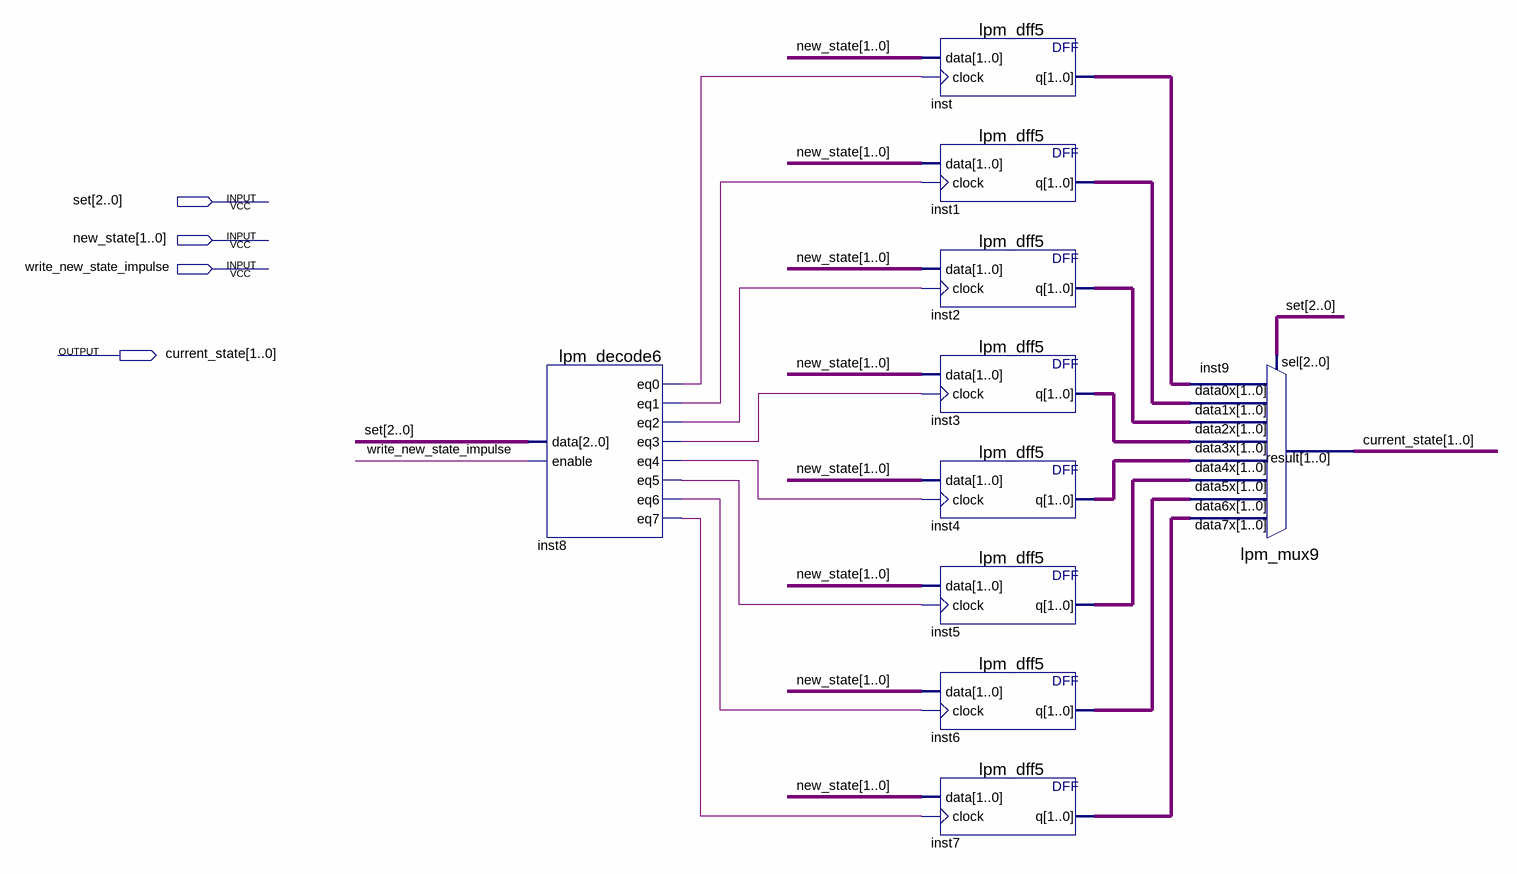
[diagram p0: schematic sheet]
// Quartus schematic PHT.bdf as structural Verilog: 10 symbols, 4 pins
module PHT (
  input  [2:0] set,
  input  [1:0] new_state,
  input  write_new_state_impulse,
  output [1:0] current_state
);

  wire inst8_eq0, inst8_eq1, inst8_eq2, inst8_eq3, inst8_eq4, inst8_eq5, inst8_eq6, inst8_eq7;
  wire [1:0] inst1_q, inst2_q, inst3_q, inst4_q, inst5_q, inst6_q, inst7_q, inst_q;

  lpm_decode6 inst8 (
    .data(set), .enable(write_new_state_impulse), .eq0(inst8_eq0), .eq1(inst8_eq1), .eq2(inst8_eq2),
    .eq3(inst8_eq3), .eq4(inst8_eq4), .eq5(inst8_eq5), .eq6(inst8_eq6), .eq7(inst8_eq7));
  lpm_dff5 inst (.data(new_state), .clock(inst8_eq0), .q(inst_q));
  lpm_dff5 inst1 (.data(new_state), .clock(inst8_eq1), .q(inst1_q));
  lpm_dff5 inst2 (.data(new_state), .clock(inst8_eq2), .q(inst2_q));
  lpm_dff5 inst3 (.data(new_state), .clock(inst8_eq3), .q(inst3_q));
  lpm_dff5 inst4 (.data(new_state), .clock(inst8_eq4), .q(inst4_q));
  lpm_dff5 inst5 (.data(new_state), .clock(inst8_eq5), .q(inst5_q));
  lpm_dff5 inst6 (.data(new_state), .clock(inst8_eq6), .q(inst6_q));
  lpm_dff5 inst7 (.data(new_state), .clock(inst8_eq7), .q(inst7_q));
  lpm_mux9 inst9 (
    .data7x(inst7_q), .data6x(inst6_q), .data5x(inst5_q), .data4x(inst4_q), .data3x(inst3_q),
    .data2x(inst2_q), .data1x(inst1_q), .data0x(inst_q), .sel(set), .result(current_state));
endmodule
